# Altium project Arm_V2.PrjPCB
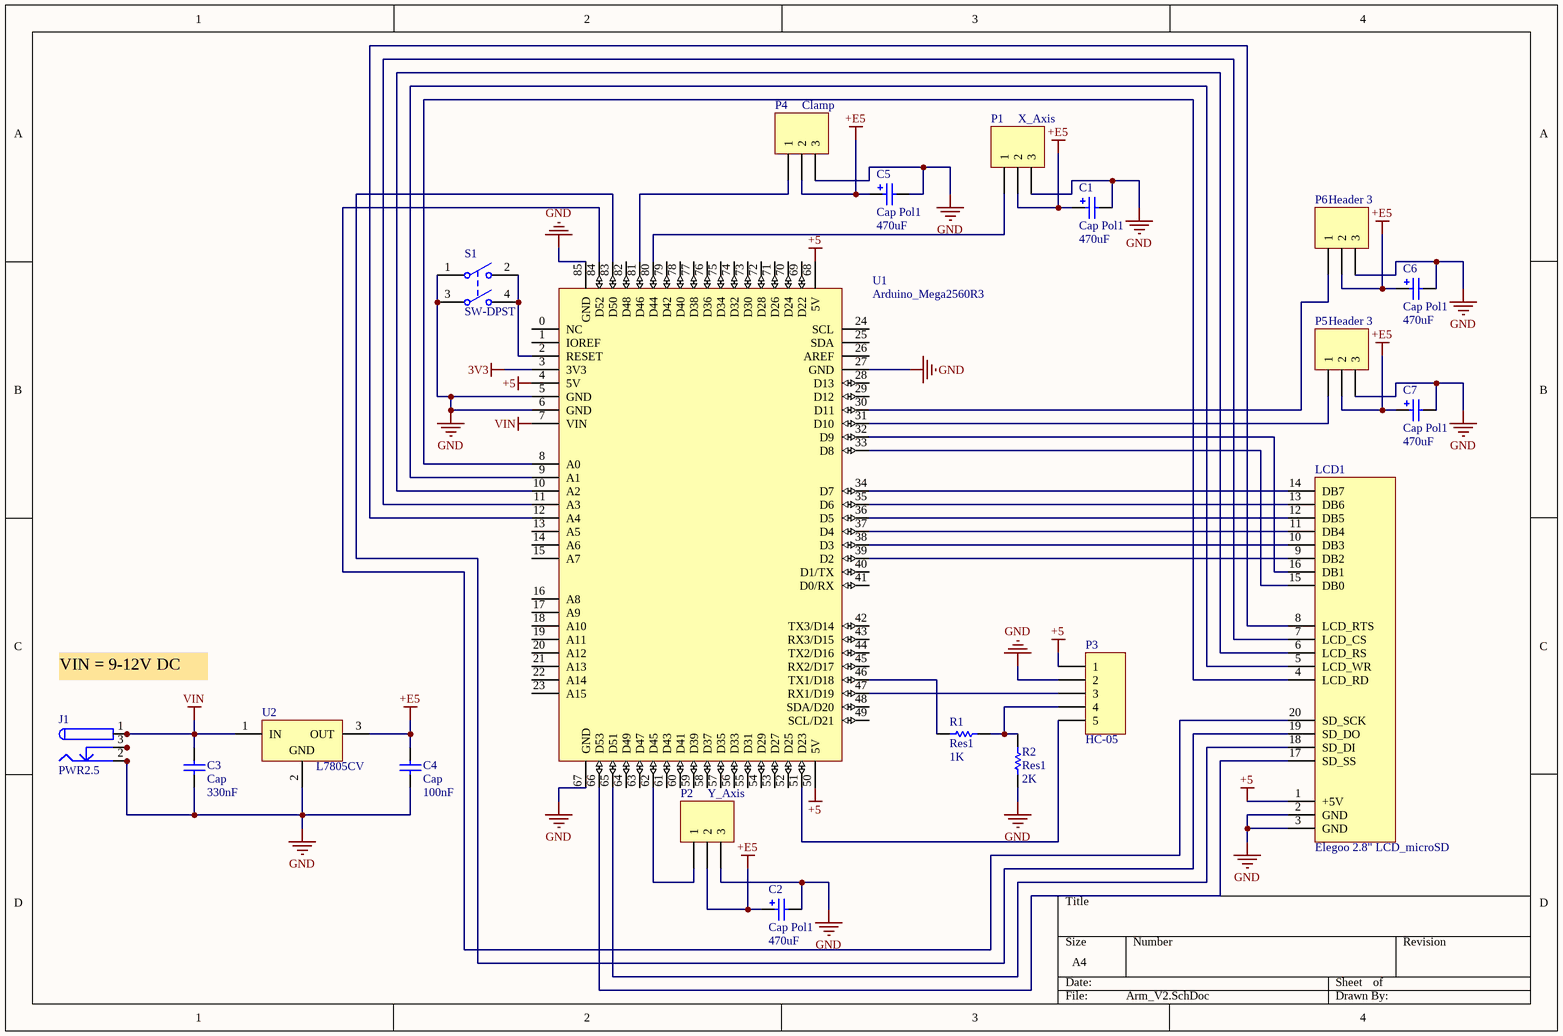
[diagram p0: Arm_V2.SchDoc]
1 sheet, 20 parts. Net scope: global (net labels, ports and power ports of the same name join across sheets).
Board file: Arm_V2.PcbDoc

## Sheet Arm_V2.SchDoc
size A4

### Parts
C1  Cap Pol1  value 470uF  [PCAP_3]
C2  Cap Pol1  value 470uF  [PCAP_3]
C3  Cap  value 330nF  [RAD-0.2]
C4  Cap  value 100nF  [RAD-0.2]
C5  Cap Pol1  value 470uF  [PCAP_3]
C6  Cap Pol1  value 470uF  [PCAP_3]
C7  Cap Pol1  value 470uF  [PCAP_3]
J1  PWR2.5  [KLD-0202]
LCD1  Elegoo 2.8" LCD_microSD  [Elegoo 2.8" LCD w/h microSD]
P1  X_Axis  [HDR1X3]
P2  Y_Axis  [HDR1X3]
P3  HC-05  [HDR1X5H]
P4  Clamp  [HDR1X3]
P5  Header 3  [HDR1X3]
P6  Header 3  [HDR1X3]
R1  Res1  value 1K  [AXIAL-0.3]
R2  Res1  value 2K  [AXIAL-0.3]
S1  SW-DPST  [DPST-4]
U1  Arduino_Mega2560R3  [ARDUINO_MEGA2560R3]
U2  L7805CV  [TO220]

### Nets
3V3: U1.3(3V3)
+5: LCD1.1(+5V) P3.1 U1.4(5V) U1.50(5V) U1.68(5V)
+E5: C1.1 C2.1 C4.2 C5.1 C6.1 C7.1 P1.2 P2.2 P4.2 P5.2 P6.2 U2.3(OUT)
GND: C1.2 C2.2 C3.1 C4.1 C5.2 C6.2 C7.2 J1.2 J1.2A J1.2B LCD1.2(GND) LCD1.3(GND) P1.3 P2.3 P3.2 P4.3 P5.3 P6.3 R2.1 S1.1(COMMON1) S1.3(COMMON2) U1.5(GND) U1.6(GND) U1.27(GND) U1.67(GND) U1.85(GND) U2.2(GND)
VIN: C3.2 J1.1 J1.1A J1.1B U1.7(VIN) U2.1(IN)
NetJ1_3: J1.3 J1.3A J1.3B
NetLCD1_4: LCD1.4(LCD_RD) U1.8(A0)
NetLCD1_5: LCD1.5(LCD_WR) U1.9(A1)
NetLCD1_6: LCD1.6(LCD_RS) U1.10(A2)
NetLCD1_7: LCD1.7(LCD_CS) U1.11(A3)
NetLCD1_8: LCD1.8(LCD_RTS) U1.12(A4)
NetLCD1_9: LCD1.9(DB2) U1.39(D2)
NetLCD1_10: LCD1.10(DB3) U1.38(D3)
NetLCD1_11: LCD1.11(DB4) U1.37(D4)
NetLCD1_12: LCD1.12(DB5) U1.36(D5)
NetLCD1_13: LCD1.13(DB6) U1.35(D6)
NetLCD1_14: LCD1.14(DB7) U1.34(D7)
NetLCD1_15: LCD1.15(DB0) U1.33(D8)
NetLCD1_16: LCD1.16(DB1) U1.32(D9)
NetLCD1_17: LCD1.17(SD_SS) U1.66(D53)
NetLCD1_18: LCD1.18(SD_DI) U1.65(D51)
NetLCD1_19: LCD1.19(SD_DO) U1.83(D50)
NetLCD1_20: LCD1.20(SD_SCK) U1.84(D52)
NetP1_1: P1.1 U1.80(D44)
NetP2_1: P2.1 U1.62(D45)
NetP3_3: P3.3 U1.47(RX1/D19)
NetP3_4: P3.4 R1.1 R2.2
NetP3_5: P3.5 U1.51(D23)
NetP4_1: P4.1 U1.81(D46)
NetP5_1: P5.1 U1.31(D10)
NetP6_1: P6.1 U1.30(D11)
NetR1_2: R1.2 U1.46(TX1/D18)
NetS1_2: S1.2(NO1) S1.4(NO2) U1.2(RESET)

Not connected (* = marked no-connect by the designer): U1 0(NC) 1(IOREF) 13(A5) 14(A6) 15(A7) 16(A8) 17(A9) 18(A10) 19(A11) 20(A12) 21(A13) 22(A14) 23(A15) 24(SCL) 25(SDA) 26(AREF) 28(D13) 29(D12) 40(D1/TX) 41(D0/RX) 42(TX3/D14) 43(RX3/D15) 44(TX2/D16) 45(RX2/D17) 48(SDA/D20) 49(SCL/D21) 52(D25) 53(D27) 54(D29) 55(D31) 56(D33) 57(D35) 58(D37) 59(D39) 60(D41) 61(D43) 63(D47) 64(D49) 69(D22) 70(D24) 71(D26) 72(D28) 73(D30) 74(D32) 75(D34) 76(D36) 77(D38) 78(D40) 79(D42) 82(D48)

### Notes on the sheet
- VIN = 9-12V DC

### Library data of the parts
C1 C2 C5-C7 = Cap Pol1: Polarized Capacitor (Radial); Published: 8-Jun-2000; LatestRevisionDate: 17-Jul-2002; LatestRevisionNote: Re-released for DXP Platform.; PackageReference: RB7.6-15; Publisher: Altium Limited; PackageDescription: Polarized Capacitor (Radial); 2 Leads
C3 C4 = Cap: Capacitor; Published: 8-Jun-2000; LatestRevisionDate: 17-Jul-2002; LatestRevisionNote: Re-released for DXP Platform.; PackageReference: RAD-0.3; Publisher: Altium Limited; PackageDescription: Radial Cap, Thru-Hole; 2 Leads; 0.3 in Pin Spacing
J1 = PWR2.5: Low Voltage Power Supply Connector; Published: 17-Dec-2003; DatasheetDocument: 09-May-2002; Publisher: Altium Limited; ComponentLink1Description: Manufacturer Link; ComponentLink1URL: http://domino.kycon.com/internet/Products.html
P1 P2 P4-P6 = Header 3: Header, 3-Pin; LatestRevisionDate: 17-Jul-2002; LatestRevisionNote: Re-released for DXP Platform.; Publisher: Altium Limited
P3 = Header 5H: Header, 5-Pin, Right Angle; LatestRevisionDate: 17-Jul-2002; LatestRevisionNote: Re-released for DXP Platform.; Publisher: Altium Limited
R1 R2 = Res1: Resistor; Published: 8-Jun-2000; LatestRevisionDate: 17-Jul-2002; LatestRevisionNote: Re-released for DXP Platform.; PackageReference: AXIAL-0.3; Publisher: Altium Limited; PackageDescription: Axial Device, Thru-Hole; 2 Leads; 0.3 in Pin Spacing
S1 = SW-DPST: Double-Pole, Single-Throw Switch; Published: 24-Mar-1999; LatestRevisionDate: 17-Jul-2002; LatestRevisionNote: Re-released for DXP Platform.; PackageReference: DPST-4; Publisher: Altium Limited; PackageDescription: Switch; 4 Leads
U2 = L7805CV: Positive Voltage Regulator, 5V, 3-Pin TO-220; DatasheetVersion: Nov-2011; PackageVersion: ver3.0; PackageReference: TO220; PackageDescription: TO, Thru-Hole, Vertical, Heatsink Mounted; 3 In-Line Leads; Pitch 2.54 mm; PartNumber: L7805CV; ComponentLink1Description: Manufacturer URL; ComponentLink1URL: http://www.st.com; ComponentLink2Description: Datasheet; ComponentLink2URL: http://www.st.com/internet/com/TECHNICAL_RESOURCES/TECHNICAL_LITERATURE/DATASHEET/CD00000444.pdf; ComponentLink3Description: Package Specification; ComponentLink3URL: http://www.st.com/internet/com/TECHNICAL_RESOURCES/TECHNICAL_LITERATURE/PACKAGE_INFORMATION/CD00004649.pdf